# EAGLE design TinyTony_ShenzenReady (EAGLE 8.7.0)
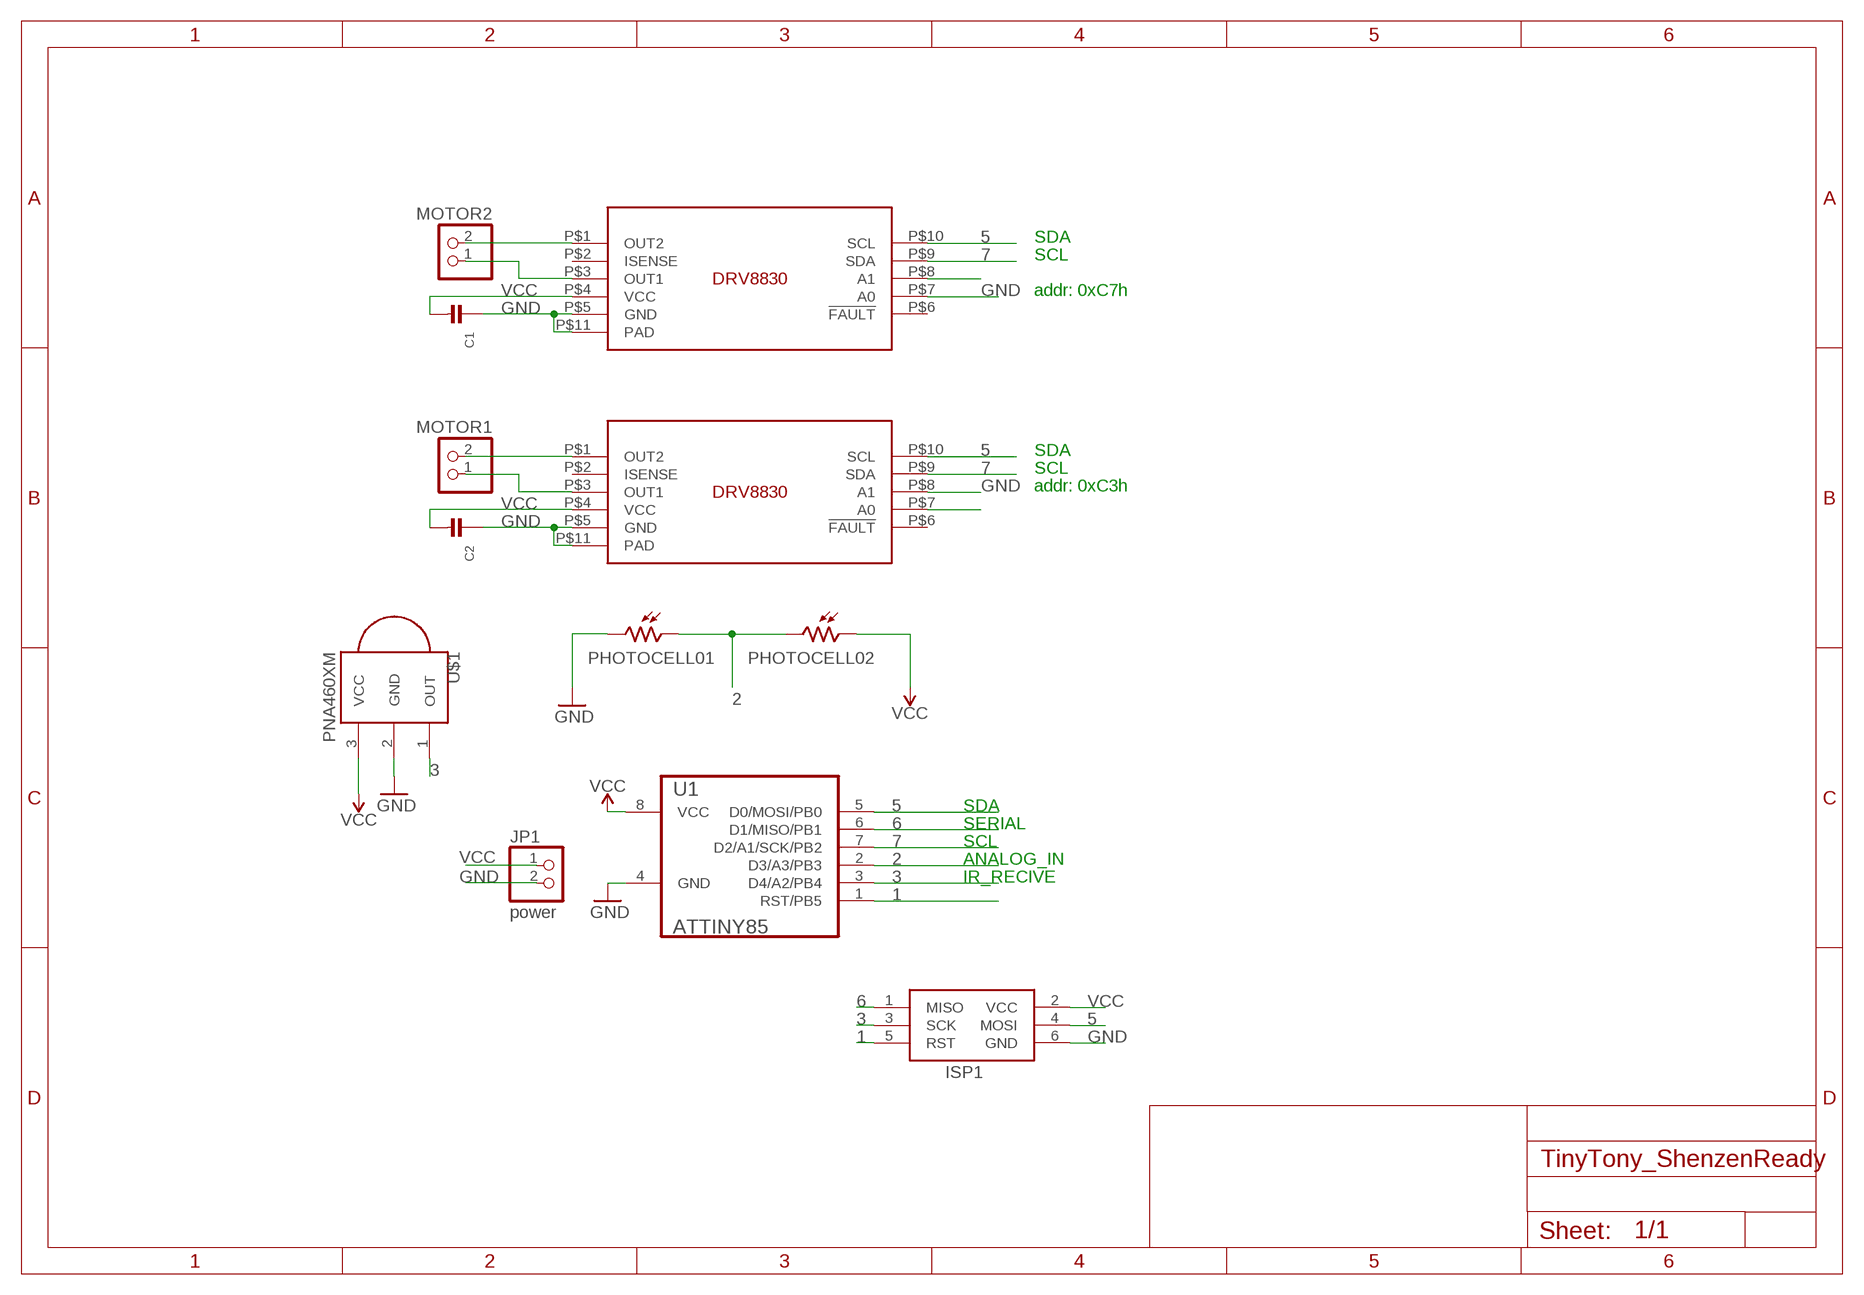
[diagram p0: schematic, sheet 1]

## Parts
C1  CAP_CERAMIC1206  [1206]
C2  CAP_CERAMIC1206  [1206]
ISP1  AVRISPPOGO  [AVRISP-50MIL]
JP1  power  HEADER-1X2ROUND  [1X02_ROUND]
JP2  MOTOR1  HEADER-1X2ROUND  [1X02_ROUND]
JP3  MOTOR2  HEADER-1X2ROUND  [1X02_ROUND]
PHOTOCELL01  PHOTOCELL0N1  [TO46-VT200]
PHOTOCELL02  PHOTOCELL0N1  [TO46-VT200]
U1  ATTINY85  ATTINY85-20SU  [SOIC127P798X216-8N]
U$1  PNA460XM  [PNA460XM]
U$2  DRV8830  [DRV8830]
U$3  DRV8830  [DRV8830]

## Nets
1: ISP1.5(RST) U1.1(RST/PB5)
2: PHOTOCELL01.1 PHOTOCELL02.2 U1.2(D3/A3/PB3)
3: ISP1.3(SCK) U1.3(D4/A2/PB4) U$1.1(OUT)
5: ISP1.4(MOSI) U1.5(D0/MOSI/PB0) U$2.P$10(SCL) U$3.P$10(SCL)
6: ISP1.1(MISO) U1.6(D1/MISO/PB1)
7: U1.7(D2/A1/SCK/PB2) U$2.P$9(SDA) U$3.P$9(SDA)
GND: C1.1 C2.1 ISP1.6(GND) JP1.2 PHOTOCELL01.2 U1.4(GND) U$1.2(GND) U$2.P$5(GND) U$2.P$8(A1) U$2.P$11(PAD) U$3.P$5(GND) U$3.P$7(A0) U$3.P$11(PAD)
N$1: U$3.P$8(A1)
N$2: JP3.1 U$3.P$3(OUT1)
N$3: JP2.1 U$2.P$3(OUT1)
N$4: JP2.2 U$2.P$1(OUT2)
N$5: JP3.2 U$3.P$1(OUT2)
N$8: U$2.P$7(A0)
VCC: C1.2 C2.2 ISP1.2(VCC) JP1.1 PHOTOCELL02.1 U1.8(VCC) U$1.3(VCC) U$2.P$4(VCC) U$3.P$4(VCC)
Unconnected: U$2.P$2(ISENSE) U$2.P$6(!FAULT) U$3.P$2(ISENSE) U$3.P$6(!FAULT)

## Notes on the sheet
- SDA
- SCL
- addr: 0xC7h
- SDA
- SCL
- addr: 0xC3h
- SDA
- SERIAL
- SCL
- ANALOG_IN
- IR_RECIVE

## Library data of the parts
C1 C2 = TinyTony_ShenzenReady:CAP_CERAMIC: Ceramic Capacitors 0402 - 0402 Surface Mount Capacitors 16pF 50V 5% [Digikey: 445-4899-2-ND] 18pF 50V 5% [Digikey: 490-1281-2-ND] 22pF 50V 5% [Digikey: 490-1283-2-ND] 68pF 50V 5% [Digikey: 490-1289-2-ND] 0.1uF 10V 10% [Digikey: 490-1318-2-ND] 1.0uF 6.3V 10% [Digikey: 490-1320-2-ND] 0603 - 0603 Surface Mount Capacitors 16 pF 50V 5% [Digikey: 445-5051-2-ND] 22 pF 50V [Digikey: PCC220ACVTR-ND] 33 pF 50V 5% [Digikey: 490-1415-1-ND] 56pF 50V 5% [Digikey: 490-1421-1-ND] 220pF 50V 5% [Digikey: 445-1285-1-ND] 680 pF 50V 2200 pF 50V 5% C0G [Digikey: 445-1297-1-ND] 5600 pF 100V 5% X7R [Digikey: 478-3711-1-ND] 0.1 µF 25V 10% [Digikey: PCC2277TR-ND] 0.22 µF 16V 10% X7R [Digikey: 445-1318-1-ND] 1.0 µF 25V 10% [Digikey: 445-5146-2-ND] 0603 - RF Specific 3pF 250V +/-0.1pF RF [Digikey: 712-1347-1-ND] 18 pF 250V 5% [Digikey: 478-3505-1-ND or 712-1322-1-ND] 56 pF 250V 5% C0G RF [Digikey: 490-4867-1-ND] 68 pF 250V RF [Digikey: 490-4868-1-ND] 0805 - 0805 Surface Mount Capacitors 220 pF 250V 2% RF Ceramic Capacitor [Digikey: 712-1398-1-ND] 1000 pF 50V 2% NP0 Ceramic Capacitor [Digikey: 478-3760-1-ND] 0.1 µF 25V 10% Ceramic Capacitor [Digikey: PCC1828TR-ND] 1.0 µF 16V 10% Ceramic Capacitor[Digikey: 490-1691-2-ND] 10.0 µF 10V 10% Ceramic Capacitor[Digikey: 709-1228-1-ND] 10.0 uF 16V 10% Ceramic Capacitor [Digikey: 478-5165-2-ND] 47 uF 6.3V 20% Ceramic Capacitor [Digikey: 587-1779-1-ND or 399-5506-1-ND] 1206 - 1206 Surface Mount Capacitors 47uF 10V 20% Ceramic Capacitor [Digikey: 490-5528-1-ND or 399-5508-1-ND or 445-6010-1-ND] 100uF 6.3V -20%, +80% Y5V Ceramic Capacitor (Digikey: 490-4512-1-ND, Mouser: 81-GRM31CF50J107ZE1L)
ISP1 = tinytony_shenzenReady:AVRISP: AVR ISP HEADER Standard 6 pin header for AVR programming
JP1-JP3 = tinytony_shenzenReady:HEADER-1X2: PIN HEADER
PHOTOCELL01 PHOTOCELL02 = TinyTony_ShenzenReady:PHOTOCELL: Photoconductive Cell VT200 Series Source: http://optoelectronics.perkinelmer.com/content/Datasheets/DTS_vt200seriesdatasheet.pdf
U1 = tinytony_shenzenReady:ATTINY85-20SU: 8-bit Microcontroller with In-System Programmable Flash; MPN: ATTINY85-20SU; OC_FARNELL: 1455164; OC_NEWARK: 58M3797; PACKAGE: SOIC-8; SUPPLIER: Atmel
U$1 = adafruit:PNA460XM: IR 38KHz receiver PNA4602 and related receivers http://www.ladyada.net/library/pcb/eaglelibrary.html
U$2 U$3 = tinytony_shenzenReady:DRV8830

## Board
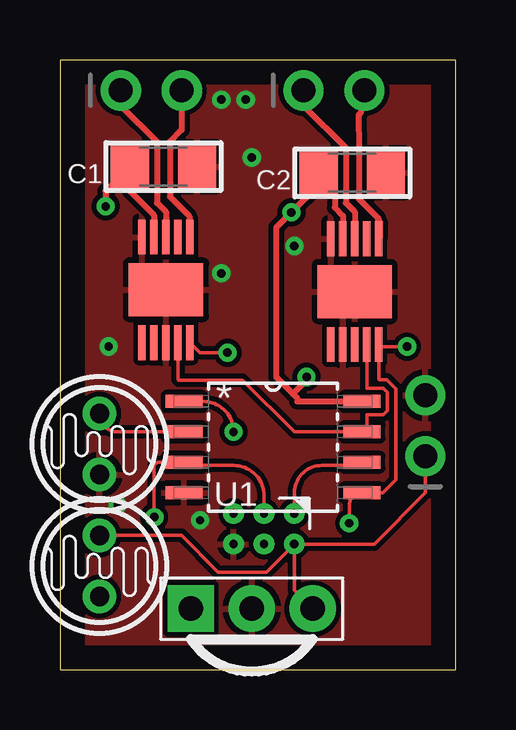
[diagram p1: board, top side]
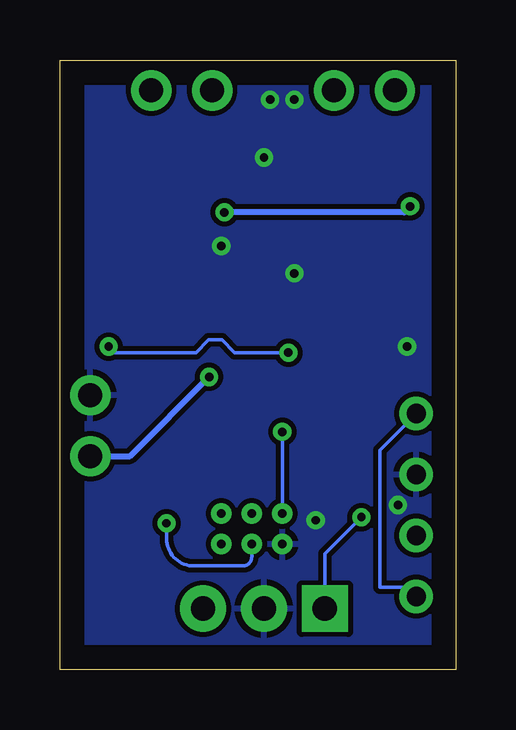
[diagram p2: board, bottom side, seen from below]

Size 16.51 x 25.4 mm. Coordinates in mm from the lower left corner, seen from the top.
Outline: 0,0 16.51,0 16.51,25.4 0,25.4 0,0
Copper layers (1*16): Top 0.035mm / dielectric 1.5mm / Bottom 0.035mm
Design rules "PCBway": minimum track width 6mil, minimum drill 0.3mm, track to track 0.205mm, track to pad 0.205mm, pad to pad 0.205mm, via to via 0.205mm, smd to smd 8mil, copper to edge 40mil, drill to drill 8mil, minimum pad ring 10mil, minimum via ring 8mil, stop-mask expansion 4mil, vias tented up to drill 25mil, thermal gap 10mil

### Footprints (pad centres in the part's own frame; a part is rotated, then mirrored left to right if it is on the bottom)
1206 = smd 1.6 x 1.8: 1 -1.4,0; 2 1.4,0
AVRISP-50MIL = drill 0.35 pad 0.8: 1 -1.27,2.54; 2 0,2.54; 3 -1.27,1.27; 4 0,1.27; 5 -1.27,0; 6 0,0
1X02_ROUND = drill 1 pad 1.676: 1 -1.27,0; 2 1.27,0
TO46-VT200 = drill 0.8 pad 1.4: 1 -1.27,0; 2 1.27,0
SOIC127P798X216-8N = smd 1.549 x 0.533: 1 -3.708,1.905; 2 -3.708,0.635; 3 -3.708,-0.635; 4 -3.708,-1.905; 5 3.708,-1.905; 6 3.708,-0.635; 7 3.708,0.635; 8 3.708,1.905
PNA460XM = drill 1.016 pad 1.93 square: 1 -2.54,0 | drill 1.016 pad 1.93: 2 0,0; 3 2.54,0
DRV8830 = smd 1.45 x 0.3: P$1 -2.2,1; P$2 -2.2,0.5; P$3 -2.2,0; P$4 -2.2,-0.5; P$5 -2.2,-1; P$6 2.2,-1; P$7 2.2,-0.5; P$8 2.2,0; P$9 2.2,0.5; P$10 2.2,1 | smd 2.2 x 3.1: P$11 0,0

### Placement (x,y rotation side)
C1  4.32,20.95 180 top
C2  12.19,20.7 180 top
ISP1  7.24,5.23 270 top
JP1  15.24,10.16 90 top
JP2  3.81,24.13 0 top
JP3  11.43,24.13 0 top
PHOTOCELL01  1.65,9.4 270 top
PHOTOCELL02  1.65,4.32 270 top
U1  8.89,9.27 0 top
U$1  8,2.54 0 top
U$2  4.42,15.82 270 top
U$3  12.29,15.75 270 top

### Tracks (layer width: path | path; a pad name or v marks a point on that pad's centre or on a via)
1  (via drill 0.35)
  Top 0.152: U1.1 5.97,11.18 arc-90 v7.24,9.91
  Bottom 0.152: v7.24,9.91 ISP1.5
2
  Top 0.152: U1.2 2.41,9.91 arc-90 PHOTOCELL01.1
  Bottom 0.152: 2.92,9.4 PHOTOCELL01.1 3.17,9.14 3.17,3.43 2.03,3.43 PHOTOCELL02.2
3  (via drill 0.35)
  Top 0.152: ISP1.3 8.51,7.24 arc90 7.24,8.51 5.31,8.51 arc-90 U1.3 4.06,8.64 3.94,8.51 v3.94,6.35
  Bottom 0.152: U$1.1 5.46,4.83 v3.94,6.35
5  (via drill 0.35)
  Top 0.152: v12.06,6.1 12.06,6.83 arc-90 U1.5 13.46,7.37 14.01,7.92 14.01,11.71 13.64,12.08 13.32,12.08 13.29,12.11 13.29,13.46 | U$3.P$10 13.29,13.46 | U$2.P$10 5.84,13.21 v6.99,13.21 | v14.48,13.46 13.29,13.46
  Bottom 0.152: ISP1.4 8.51,4.7 arc90 8.89,4.32 10.92,4.32 arc90 12.06,5.46 v12.06,6.1 | v14.48,13.46 14.22,13.21 10.84,13.21 10.31,13.74 9.76,13.74 9.23,13.21 v6.99,13.21
6
  Top 0.152: ISP1.1 9.78,7.37 arc-90 10.92,8.51 12.47,8.51 arc90 U1.6
7
  Top 0.152: U$2.P$9 4.92,12.1 4.95,12.06 7.62,12.06 9.78,9.91 U1.7 12.79,10.1 12.79,10.63 13.49,10.63 13.65,10.79 13.65,11.56 13.49,11.72 12.79,11.72 U$3.P$9
GND  (via drill 0.35)
  other vias: 5.84,6.22 6.73,23.75 7.75,23.75 8,21.34 9.78,17.65 2.41,6.86 2.03,13.46 6.73,16.51
  pour Bottom: -1.27,25.4 -1.27,-1.27 17.78,-1.27 17.78,25.4
  pour Top: 0,25.4 0,1.27 1.27,0 16.51,0 16.51,25.4
N$2
  Top 0.254: JP3.1 10.16,23.5 11.92,21.74 11.92,19.45 12.29,19.07 U$3.P$3
N$3
  Top 0.254: JP2.1 2.54,23.5 4.05,21.99 4.05,19.45 4.42,19.07 U$2.P$3
N$4
  Top 0.254: U$2.P$1 5.4,18.04 5.4,18.89 4.59,19.7 4.59,21.99 5.08,22.49 JP2.2
N$5
  Top 0.254: JP3.2 12.52,23.17 12.46,23.11 12.46,21.74 12.46,19.63 13.28,18.81 13.28,18.73 13.34,18.67 13.34,17.99 U$3.P$1
VCC  (via drill 0.35)
  Top 0.152: PHOTOCELL02.1 5.08,5.59 6.6,4.06 8.61,4.06 ISP1.2 | ISP1.2 9.78,3.3 U$1.3 | ISP1.2 13.11,5.23 15.24,7.37 JP1.1
  Top 0.254: U$2.P$4 3.92,18.93 2.92,19.93 C1.2 1.91,19.94 v1.91,19.3 | U$3.P$4 11.81,17.96 11.81,18.91 11.46,19.25 11.46,20.03 C2.2 10.79,20.19 v9.65,19.05 9.02,18.41 9.02,12.19 9.72,11.49 | 9.72,11.49 9.91,11.3 9.91,11.18 U1.8 | v10.29,12.19 10.29,12.06 9.72,11.49
  Bottom 0.254: v1.91,19.3 2.16,19.05 v9.65,19.05 | JP1.1 13.59,8.89 v10.29,12.19